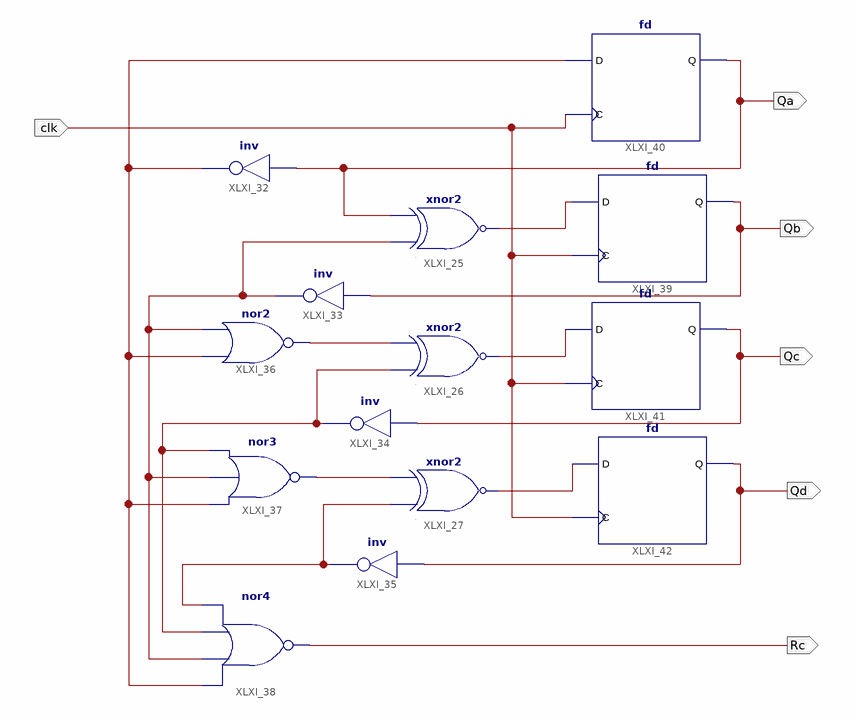
[diagram p0: schematic sheet 1]
// Xilinx ISE schematic Counter_4bit.sch (kintex7) as structural Verilog: 14 symbols, 6 ports
module Counter_4bit (
  input  clk,
  output Qa,
  output Qb,
  output Qc,
  output Qd,
  output Rc
);

  wire nQa, nQb, nQc, nQd, XLXN_30, XLXN_31, XLXN_32, XLXN_39, XLXN_40;

  xnor XLXI_25 (XLXN_30, nQb, Qa);
  xnor XLXI_26 (XLXN_31, nQc, XLXN_39);
  xnor XLXI_27 (XLXN_32, nQd, XLXN_40);
  not XLXI_32 (nQa, Qa);
  not XLXI_33 (nQb, Qb);
  not XLXI_34 (nQc, Qc);
  not XLXI_35 (nQd, Qd);
  nor XLXI_36 (XLXN_39, nQa, nQb);
  nor XLXI_37 (XLXN_40, nQa, nQb, nQc);
  nor XLXI_38 (Rc, nQa, nQb, nQc, nQd);
  fd XLXI_39 (.C(clk), .D(XLXN_30), .Q(Qb));
  fd XLXI_40 (.C(clk), .D(nQa), .Q(Qa));
  fd XLXI_41 (.C(clk), .D(XLXN_31), .Q(Qc));
  fd XLXI_42 (.C(clk), .D(XLXN_32), .Q(Qd));
endmodule
